# EAGLE design light_detector_ALR (EAGLE 7.7.0)
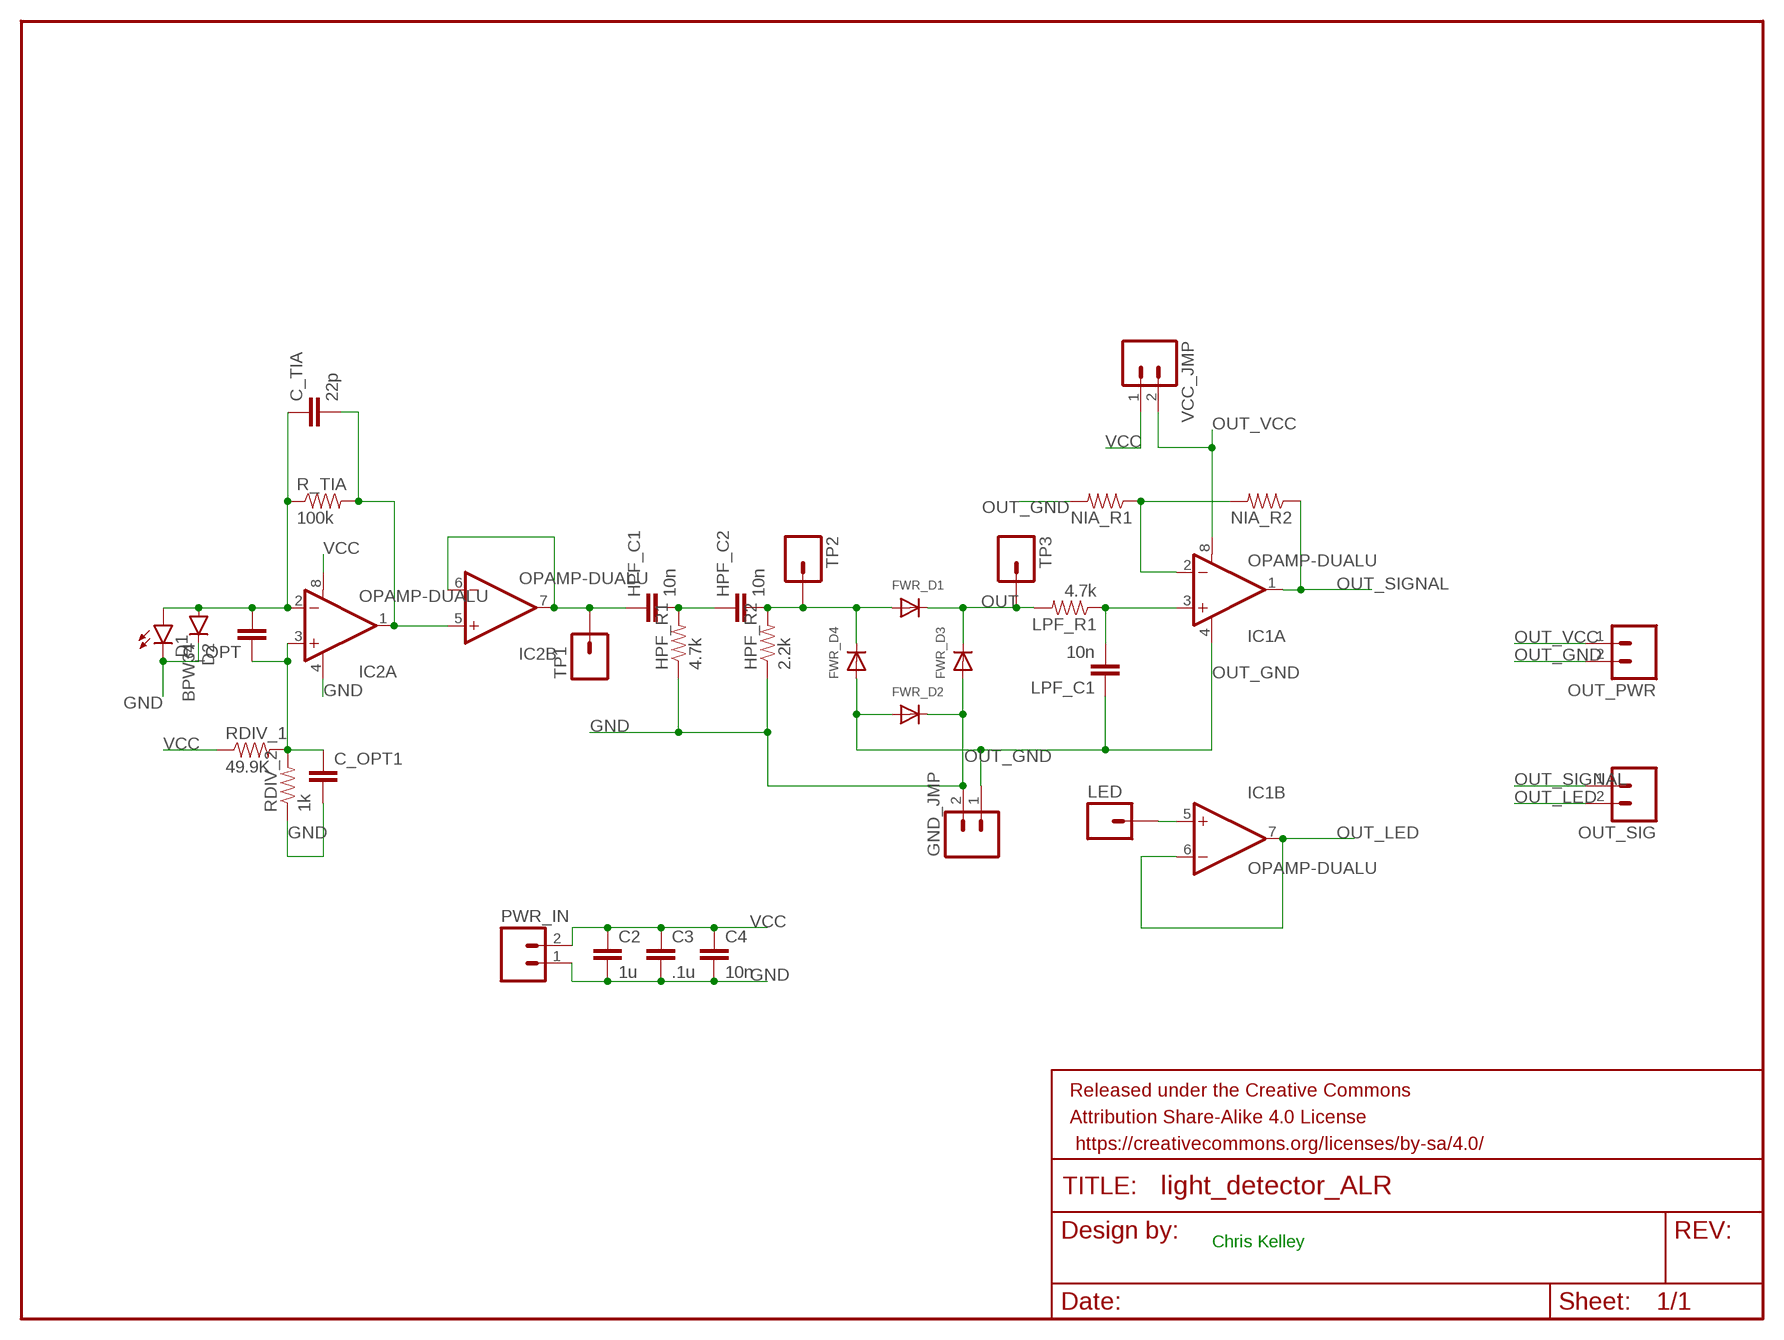
[diagram p0: schematic, sheet 1]

## Parts
C2  1u  CAP0805  [0805]
C3  .1u  CAP0805  [0805]
C4  10n  CAP0805  [0805]
C_OPT  CAP0805  [0805]
C_OPT1  CAP0805  [0805]
C_TIA  22p  CAP0805  [0805]
D1  LED5MM  [LED5MM]
D2  BPW34  [BPW34]
FRAME1  FRAME-LETTER  [CREATIVE_COMMONS]
FWR_D1  DIODESOD-123  [SOD-123]
FWR_D2  DIODESOD-123  [SOD-123]
FWR_D3  DIODESOD-123  [SOD-123]
FWR_D4  DIODESOD-123  [SOD-123]
GND_JMP  M02PTH  [1X02]
HPF_C1  10n  CAP0805  [0805]
HPF_C2  10n  CAP0805  [0805]
HPF_R1  4.7k  RESISTOR0603-RES  [0603-RES]
HPF_R2  2.2k  RESISTOR0603-RES  [0603-RES]
IC1  OPAMP-DUALU  [SO08]
IC2  OPAMP-DUALU  [SO08]
LED  M01PTH  [1X01]
LPF_C1  10n  CAP0805  [0805]
LPF_R1  4.7k  RESISTOR0603-RES  [0603-RES]
NIA_R1  RESISTOR0603-RES  [0603-RES]
NIA_R2  RESISTOR0603-RES  [0603-RES]
OUT_PWR  M02PTH  [1X02]
OUT_SIG  M02PTH  [1X02]
PWR_IN  M02PTH  [1X02]
R_TIA  100k  RESISTOR0603-RES  [0603-RES]
RDIV_1  49.9K  RESISTOR0603-RES  [0603-RES]
RDIV_2  1k  RESISTOR0603-RES  [0603-RES]
TP1  M01PTH  [1X01]
TP2  M01PTH  [1X01]
TP3  M01PTH  [1X01]
VCC_JMP  M02PTH  [1X02]

## Nets
GND: C2.2 C3.2 C4.2 C_OPT1.2 D1.K(C) D2.P$2(C) FWR_D2.C FWR_D3.A GND_JMP.2 HPF_R1.1 HPF_R2.1 IC2.4(A:V-) PWR_IN.1 RDIV_2.1
N$1: C_OPT.2 C_TIA.1 D1.A D2.P$1(A) IC2.2(A:-IN) R_TIA.1
N$2: C_TIA.2 IC2.1(A:OUT) IC2.5(B:+IN) R_TIA.2
N$3: C_OPT1.1 C_OPT.1 IC2.3(A:+IN) RDIV_1.2 RDIV_2.2
N$4: HPF_C1.2 HPF_C2.1 HPF_R1.2
N$5: HPF_C1.1 IC2.6(B:-IN) IC2.7(B:OUT) TP1.1
N$6: FWR_D1.A FWR_D4.C HPF_C2.2 HPF_R2.2 TP2.1
N$7: IC1.3(A:+IN) LPF_C1.2 LPF_R1.1
N$8: IC1.2(A:-IN) NIA_R1.1 NIA_R2.2
N$9: IC1.5(B:+IN) LED.1
OUT: FWR_D1.C FWR_D3.C LPF_R1.2 TP3.1
OUT_GND: FWR_D2.A FWR_D4.A GND_JMP.1 IC1.4(A:V-) LPF_C1.1 NIA_R1.2 OUT_PWR.2
OUT_LED: IC1.6(B:-IN) IC1.7(B:OUT) OUT_SIG.2
OUT_SIGNAL: IC1.1(A:OUT) NIA_R2.1 OUT_SIG.1
OUT_VCC: IC1.8(A:V+) OUT_PWR.1 VCC_JMP.2
VCC: C2.1 C3.1 C4.1 IC2.8(A:V+) PWR_IN.2 RDIV_1.1 VCC_JMP.1

## Notes on the sheet
- Chris Kelley

## Library data of the parts
C2-C4 C_OPT C_OPT1 C_TIA HPF_C1 HPF_C2 LPF_C1 = SparkFun-Passives:CAP: Capacitor Standard 0603 ceramic capacitor, and 0.1" leaded capacitor.
D1 = SparkFun-LED:LED: LEDs Standard schematic elements and footprints for 5mm, 3mm, 1206, and 0603 sized LEDs. 5mm - Spark Fun Electronics SKU : COM-00529 (and others)
D2 = SparkFun-Sensors:BPW34: Large-area PIN photodiode ("miniature solar cell") Datasheet: https://www.sparkfun.com/datasheets/Prototyping/Solar/bpw34.pdf; STOREID: 9541
FRAME1 = SparkFun-Aesthetics:FRAME-LETTER: Schematic Frame Standard 8.5x11 US Letter frame
FWR_D1-FWR_D4 = adafruit:DIODE: Diode SMADIODE - SMA Surface Mount Package 20V 1A Schottky Diode Digikey: 641-1014-6-ND DO-1N4148 - Through Hole Small Current Diode SOD-123 20V 1 A (.5mV Vf) Schottky Diode - Digikey: MBRX120TPMSCT-ND SOD-323 10V 570mA (.38mV Vf, 3ns) Schottky Diode - Digikey: ZLLS410CT-ND SOD-523 30V 30mA Schottky Diode (RB751S-40TE61) - Digikey: RB751S-40TE61CT-ND SOT23-R/W - SOT23 Package (R = Solder Paste/Reflow Ovens, W = Hand-Soldering) BAT54Film 40V 300mA - Digikey: 497-7162-1-ND
GND_JMP OUT_PWR OUT_SIG PWR_IN VCC_JMP = SparkFun-Connectors:M02: Standard 2-pin 0.1" header. Use with - straight break away headers ( PRT-00116) - right angle break away headers (PRT-00553) - swiss pins (PRT-00743) - machine pins (PRT-00117) - female headers (PRT-00115) Molex polarized connector foot print use with: PRT-08233 with associated crimp pins and housings. 2.54_SCREWTERM for use with PRT-10571. 3.5mm Screw Terminal footprints for PRT-08084 5mm Screw Terminal footprints for use with PRT-08432
HPF_R1 HPF_R2 LPF_R1 NIA_R1 NIA_R2 R_TIA RDIV_1 RDIV_2 = SparkFun-Passives:RESISTOR: Resistor Basic schematic elements and footprints for 0603, 1206, and PTH resistors.
IC1 IC2 = SparkFun-AnalogIC:OPAMP-DUAL: Generic op-amp footprint
LED TP1-TP3 = SparkFun-Connectors:M01: Header 1 Standard 1-pin 0.1" header. Use with straight break away headers (SKU : PRT-00116), right angle break away headers (PRT-00553), swiss pins (PRT-00743), machine pins (PRT-00117), and female headers (PRT-00115).

## Board
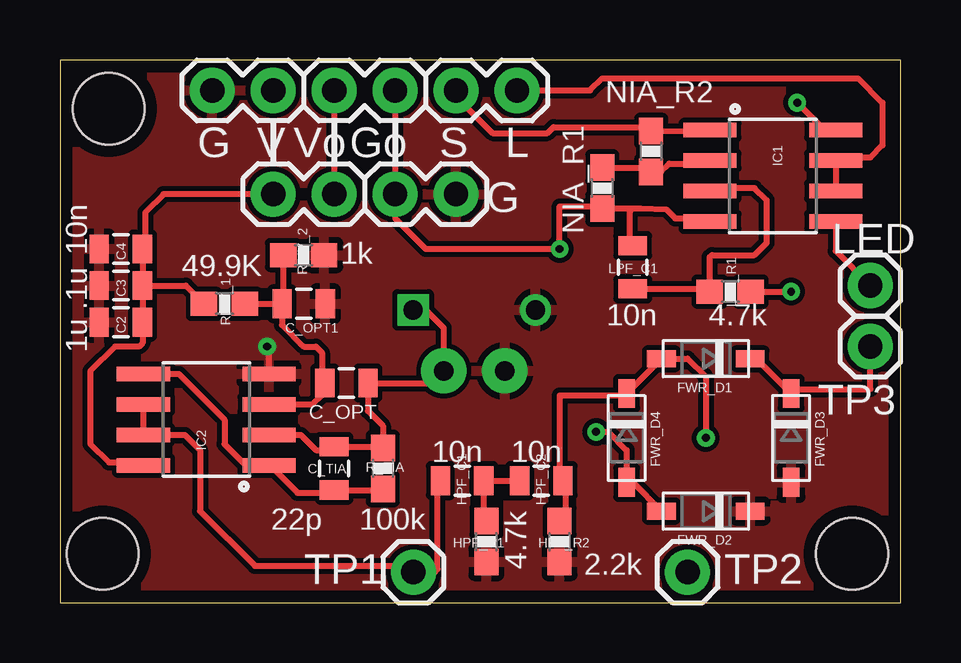
[diagram p1: board, top side]
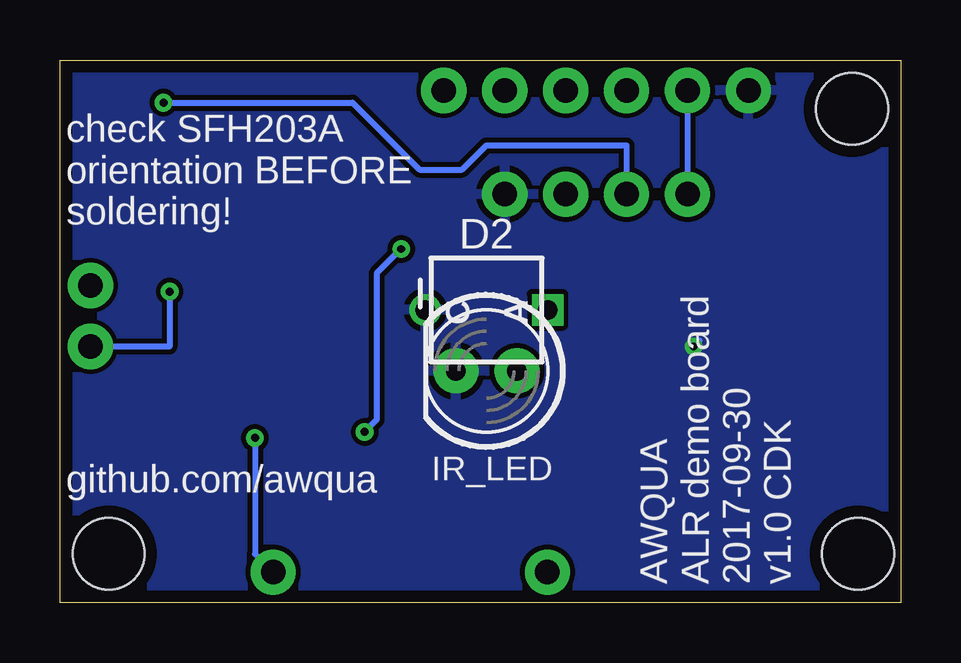
[diagram p2: board, bottom side, seen from below]

Size 35.05 x 22.61 mm. Coordinates in mm from the lower left corner, seen from the top.
Outline: 0,22.61 0,0 35.05,0 35.05,22.61 0,22.61
Copper layers (1*16): Top 0.035mm / dielectric 1.5mm / Bottom 0.035mm
Design rules "default *": minimum track width 8mil, minimum drill 12mil, track to track 8mil, track to pad 8mil, pad to pad 8mil, via to via 8mil, smd to smd 8mil, copper to edge 20mil, drill to drill 8mil, minimum pad ring 10mil, minimum via ring 8mil, stop-mask expansion 2mil, vias tented up to drill 13mil, thermal gap 10mil
Holes 3 mm at 2.03,20.57 1.78,2.03 33.02,2.03

### Footprints (pad centres in the part's own frame; a part is rotated, then mirrored left to right if it is on the bottom)
0805 = smd 0.8 x 1.2: 1 -0.9,0; 2 0.9,0
LED5MM = drill 0.813 pad 1.88: A -1.27,0; K 1.27,0
BPW34 = drill 0.8 square: P$1 0,2.55 | drill 0.8: P$2 0,-2.55
SOD-123 = smd 1.2 x 0.7: A 1.85,0; C -1.85,0
1X02 = drill 1.016 pad 1.88: 1 0,0; 2 2.54,0
0603-RES = smd 1.1 x 1: 1 -0.85,0; 2 0.85,0
SO08 = smd 0.61 x 2.21: 1 -1.905,-2.616; 2 -0.635,-2.616; 3 0.635,-2.616; 4 1.905,-2.616; 5 1.905,2.616; 6 0.635,2.616; 7 -0.635,2.616; 8 -1.905,2.616
1X01 = drill 1.016 pad 1.88: 1 0,0

### Placement (x,y rotation side)
C2  2.54,11.68 180 top
C3  2.54,13.21 180 top
C4  2.54,14.73 180 top
C_OPT  11.94,9.14 0 top
C_OPT1  10.16,12.45 0 top
C_TIA  11.43,5.59 270 top
D1  17.27,9.65 180 bottom
D2  17.27,12.19 270 bottom
FRAME1  -8.13,-10.67 0 top  (outside the outline)
FWR_D1  26.92,10.16 180 top
FWR_D2  26.92,3.81 180 top
FWR_D3  30.48,6.86 270 top
FWR_D4  23.62,6.86 270 top
GND_JMP  13.97,17.02 0 top
HPF_C1  16.76,5.08 0 top
HPF_C2  20.07,5.08 0 top
HPF_R1  17.78,2.54 90 top
HPF_R2  20.83,2.54 90 top
IC1  29.72,17.78 270 top
IC2  6.1,7.62 90 top
LED  33.78,13.21 0 top
LPF_C1  23.88,13.97 270 top
LPF_R1  27.94,12.95 0 top
NIA_R1  22.61,17.27 270 top
NIA_R2  24.64,18.8 270 top
OUT_PWR  11.43,21.34 0 top
OUT_SIG  16.51,21.34 0 top
PWR_IN  6.35,21.34 0 top
R_TIA  13.46,5.59 270 top
RDIV_1  6.86,12.45 0 top
RDIV_2  10.16,14.48 180 top
TP1  14.73,1.27 0 top
TP2  26.16,1.27 0 top
TP3  33.78,10.67 0 top
VCC_JMP  8.89,17.02 0 top

### Tracks (layer width: path | path; a pad name or v marks a point on that pad's centre or on a via)
GND  (via drill 0.33)
  Top 0.254: IC2.4 8.71,10.59 v8.64,10.67
  Bottom 0.254: v8.64,10.67 8.38,10.92
  pour Bottom: -5.33,42.16 71.37,43.69 70.61,-2.29 -5.84,-3.3
  pour Top: -4.06,40.89 72.39,41.91 71.88,-3.56 -4.57,-4.57
N$1
  Top 0.254: IC2.2 10.03,6.99 10.67,6.35 11.29,6.35 C_TIA.1 13.41,6.49 R_TIA.1 13.46,7.37 12.84,7.99 C_OPT.2 15.49,9.14 D1.A 16,11.43 15.24,12.19 D2.P$1
N$2
  Top 0.254: IC2.5 4.95,9.53 6.86,7.62 6.86,6.6 7.87,5.59 8.59,5.59 IC2.1 8.76,5.71 9.91,4.57 11.31,4.57 C_TIA.2 13.41,4.69 R_TIA.2
N$3
  Top 0.254: RDIV_1.2 C_OPT1.1 | RDIV_2.2 9.31,12.5 C_OPT1.1 | C_OPT1.1 9.26,11.57 10.16,10.67 10.67,10.67 10.92,10.41 10.92,9.26 C_OPT.1 10.92,9.03 10.92,8.64 10.54,8.26 IC2.3
N$4
  Top 0.254: HPF_R1.2 17.66,3.51 HPF_C1.2 HPF_C2.1
N$5
  Top 0.254: IC2.6 IC2.7 5.21,6.99 5.84,6.35 5.84,3.81 8.13,1.52 14.48,1.52 TP1.1 15.61,1.27 15.75,1.41 15.75,4.83 HPF_C1.1
N$6  (via drill 0.33)
  Top 0.254: HPF_C2.2 21.08,5.08 21.08,3.81 HPF_R2.2 | HPF_C2.2 20.97,5.47 | v26.92,6.86 26.92,9.4 26.16,10.16 FWR_D1.A FWR_D4.C 23.55,8.64 20.83,8.64 20.83,5.22 HPF_C2.2
  Bottom 0.254: v26.92,6.86 26.92,2.03 TP2.1
N$7
  Top 0.254: IC1.3 27.23,17.27 28.96,17.27 29.46,16.76 29.46,14.99 28.96,14.48 27.18,14.48 27.09,14.39 LPF_R1.1 26.97,13.07 LPF_C1.2
N$8
  Top 0.254: NIA_R1.1 24.56,18.12 NIA_R2.2 25.06,17.95 25.4,18.29 26.98,18.29 IC1.2
N$9
  Top 0.254: IC1.5 32.33,14.66 LED.1
OUT  (via drill 0.33)
  Top 0.254: FWR_D1.C 29.03,10.16 FWR_D3.C 30.48,8.89 33.78,8.89 TP3.1 | LPF_R1.2 v30.48,12.95
  Bottom 0.254: v30.48,12.95 30.48,10.67 TP3.1
OUT_GND  (via drill 0.33)
  Top 0.254: FWR_D2.A 23.88,5.01 FWR_D4.A 23.62,6.35 22.86,7.11 v22.35,7.11 | OUT_PWR.2 GND_JMP.1 13.97,16 15.24,14.73 v20.83,14.73 20.83,16.51 22.52,16.51 NIA_R1.2 23.88,16.42 | 23.88,16.42 24.22,16.42 25.27,16.38 25.65,16 26.98,16 IC1.4 | LPF_C1.1 23.76,14.87 23.76,16.31 23.88,16.42
  Bottom 0.254: v20.83,14.73 21.84,13.72 21.84,7.62 v22.35,7.11
OUT_LED
  Top 0.254: IC1.7 IC1.6 | OUT_SIG.2 22.1,21.34 22.61,21.84 33.27,21.84 34.29,20.83 34.29,19.05 33.78,18.54 32.46,18.54 IC1.7 | 32.21,18.54 IC1.7
OUT_SIGNAL
  Top 0.254: IC1.1 24.86,19.65 NIA_R2.1 24.55,19.81 20.57,19.81 20.32,19.56 18.03,19.56 16.51,21.08 OUT_SIG.1
OUT_VCC  (via drill 0.33)
  Top 0.254: OUT_PWR.1 VCC_JMP.2 | IC1.8 31.88,19.68 v30.73,20.83
  Bottom 0.254: v30.73,20.83 22.86,20.83 20.07,18.03 18.29,18.03 17.27,19.05 11.43,19.05 VCC_JMP.2
VCC
  Top 0.254: VCC_JMP.1 4.32,17.02 3.56,16.26 3.56,14.85 C4.1 C3.1 | C3.1 C2.1 3.44,10.81 3.3,10.67 2.29,10.67 1.27,9.65 1.27,6.6 2.03,5.84 3.35,5.84 IC2.8 | C3.1 5.25,13.21 RDIV_1.1
  Bottom 0.254: PWR_IN.2 VCC_JMP.1

### Text on the board
tPlace: Chris Kelley / AWQUA
bPlace: check SFH203A / orientation BEFORE / soldering! | IR_LED | github.com/awqua | AWQUA / ALR demo board / 2017-09-30 / v1.0 CDK
tNames: G | V | Vo | Go | S | L | G